# EAGLE design 16 PWM LEDs Module (EAGLE 6.3)
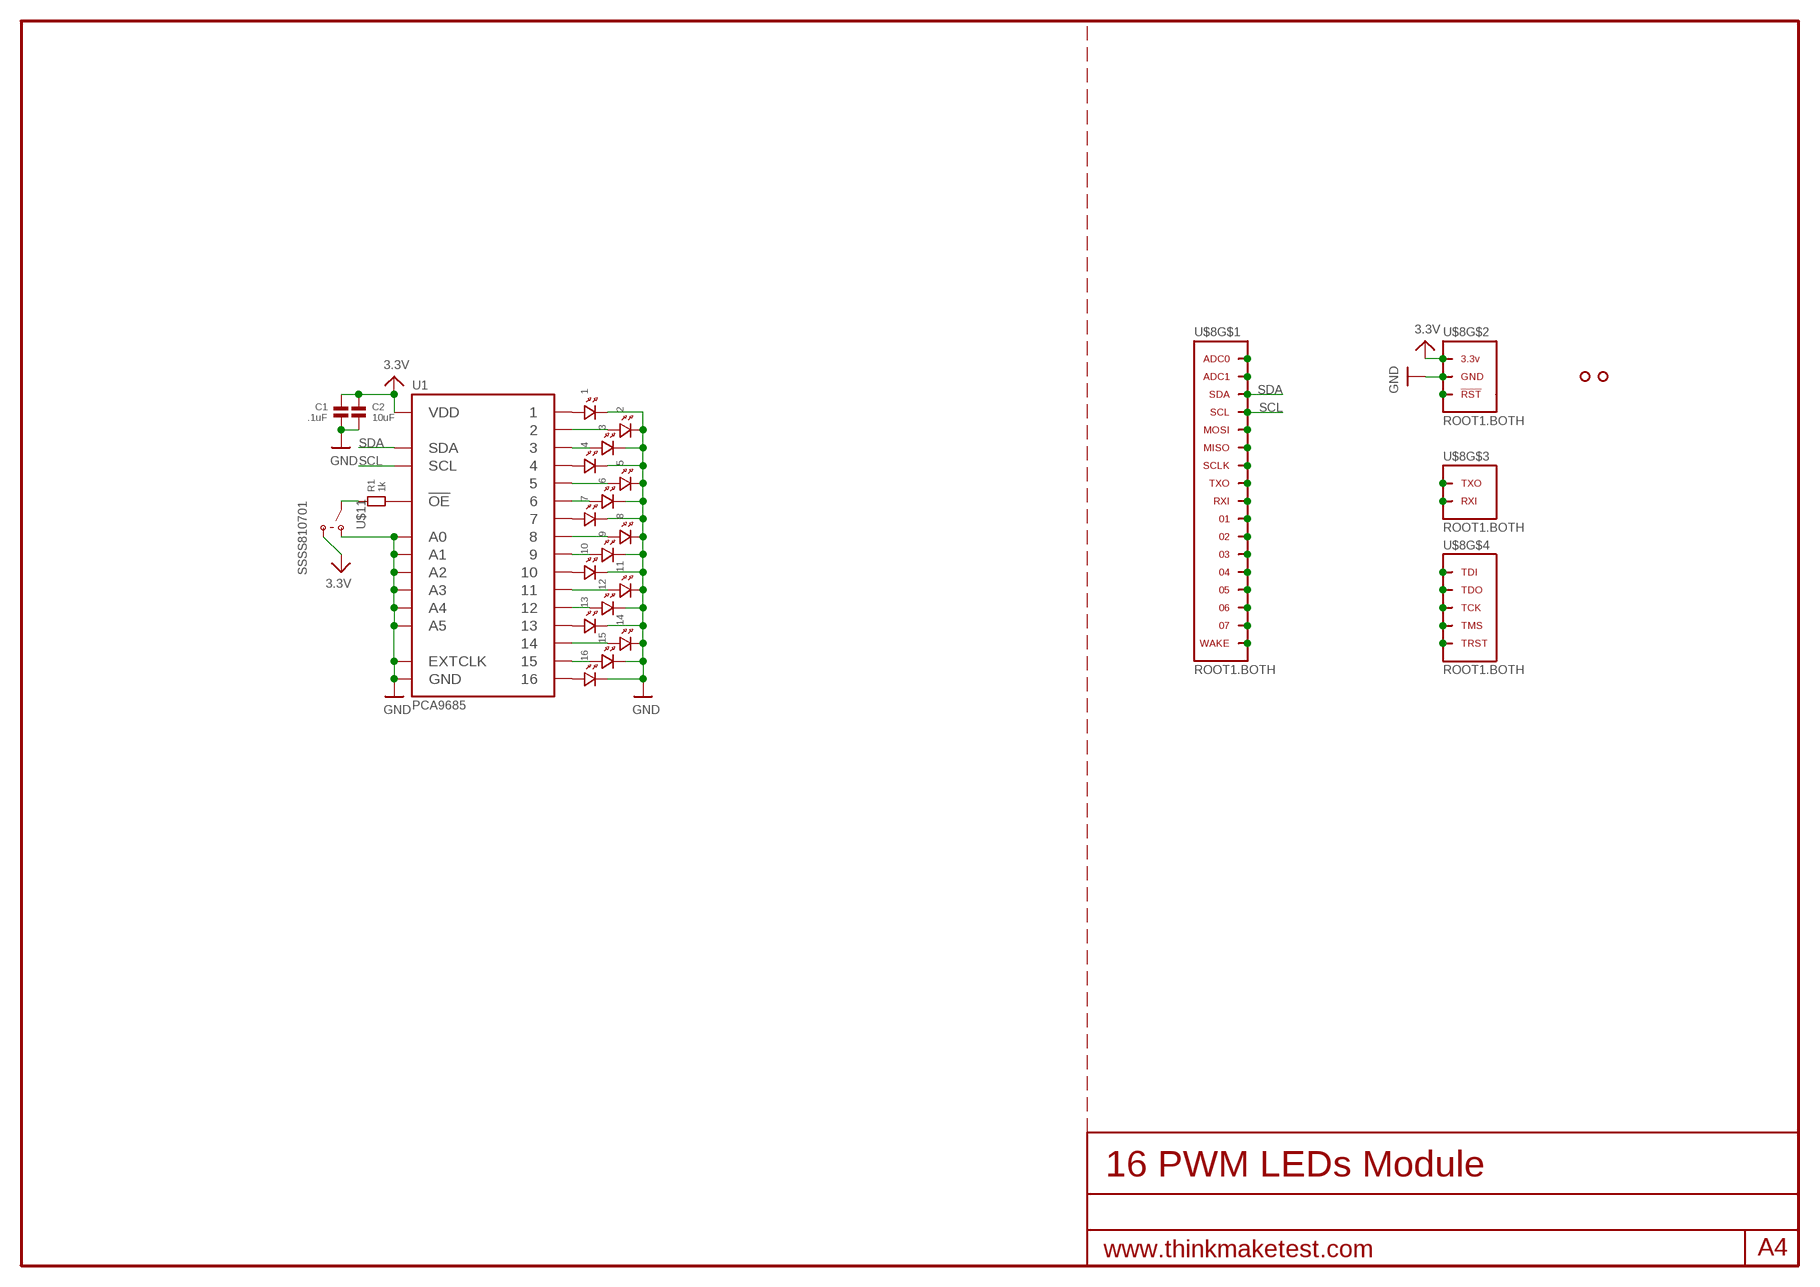
[diagram p0: schematic, sheet 1]

## Parts
1  LED.0603  [0603.LED]
2  LED.0603  [0603.LED]
3  LED.0603  [0603.LED]
4  LED.0603  [0603.LED]
5  LED.0603  [0603.LED]
6  LED.0603  [0603.LED]
7  LED.0603  [0603.LED]
8  LED.0603  [0603.LED]
9  LED.0603  [0603.LED]
10  LED.0603  [0603.LED]
11  LED.0603  [0603.LED]
12  LED.0603  [0603.LED]
13  LED.0603  [0603.LED]
14  LED.0603  [0603.LED]
15  LED.0603  [0603.LED]
16  LED.0603  [0603.LED]
C1  .1uF  CAPACITOR.0603  [0603]
C2  10uF  CAPACITOR.0805  [0805]
R1  1k  RESISTOR.0603  [0603]
U1  PCA9685  [HVQFN28]
U$3  HOLE.2MM  [2MM]
U$4  HOLE.2MM  [2MM]
U$8  ROOT1.BOTH  [ROOT1.BOTH]
U$11  SSSS810701  [SSSS810701]

## Nets
3.3V: C1.1 C2.1 U1.28(VDD) U$8.3.3V@1(3.3V) U$8.3.3V@2(3.3V) U$8.3.3V@3(3.3V) U$8.3.3V@4(3.3V) U$8.3.3V@5(3.3V) U$8.3.3V@6(3.3V) U$8.3.3V@7(3.3V) U$8.3.3V@8(3.3V) U$8.3.3V@9(3.3V) U$8.3.3V@10(3.3V) U$8.3.3V@11(3.3V) U$8.3.3V@12(3.3V) U$8.3.3V@13(3.3V) U$8.3.3V@14(3.3V) U$8.3.3V@15(3.3V) U$8.3.3V@16(3.3V) U$8.3.3V@17(3.3V) U$8.3.3V@18(3.3V) U$8.3.3V@19(3.3V) U$8.3.3V@20(3.3V) U$8.3.3V@21(3.3V) U$8.3.3V@22(3.3V) U$8.3.3V@23(3.3V) U$8.3.3V@24(3.3V) U$8.3.3V@VIA(3.3V) U$11.1(B)
GND: 1.P$2 2.P$2 3.P$2 4.P$2 5.P$2 6.P$2 7.P$2 8.P$2 9.P$2 10.P$2 11.P$2 12.P$2 13.P$2 14.P$2 15.P$2 16.P$2 C1.2 C2.2 U1.1(A0) U1.2(A1) U1.3(A2) U1.4(A3) U1.5(A4) U1.14(GND) U1.24(A5) U1.25(EXTCLK) U1.PAD(GND) U$8.GND@1(GND) U$8.GND@2(GND) U$8.GND@3(GND) U$8.GND@4(GND) U$8.GND@5(GND) U$8.GND@6(GND) U$8.GND@7(GND) U$8.GND@8(GND) U$8.GND@9(GND) U$8.GND@10(GND) U$8.GND@11(GND) U$8.GND@12(GND) U$8.GND@13(GND) U$8.GND@14(GND) U$8.GND@15(GND) U$8.GND@16(GND) U$8.GND@17(GND) U$8.GND@18(GND) U$8.GND@19(GND) U$8.GND@20(GND) U$8.GND@21(GND) U$8.GND@22(GND) U$8.GND@23(GND) U$8.GND@24(GND) U$8.GND@25(GND) U$8.GND@26(GND) U$8.GND@VIA(GND) U$11.3(A)
N$1: U$8.ADC0 U$8.ADC0@1(ADC0) U$8.ADC0@VIA(ADC0)
N$2: U$8.ADC1 U$8.ADC1@1(ADC1) U$8.ADC1@VIA(ADC1)
N$3: R1.2 U1.23(!OE)
N$4: R1.1 U$11.2(COM)
N$5: U$8.MOSI U$8.MOSI@1(MOSI) U$8.MOSI@VIA(MOSI)
N$6: U$8.MISO U$8.MISO@1(MISO) U$8.MISO@VIA(MISO)
N$7: U$8.SCLK U$8.SCLK@1(SCLK) U$8.SCLK@VIA(SCLK)
N$8: U$8.TXO U$8.TXO@1(TXO) U$8.TXO@VIA(TXO)
N$9: U$8.RXI U$8.RXI@1(RXI) U$8.RXI@VIA(RXI)
N$10: U$8.01 U$8.01@1 U$8.01@VIA
N$11: U$8.02 U$8.02@1 U$8.02@VIA
N$12: U$8.03 U$8.03@1 U$8.03@VIA
N$13: U$8.04 U$8.04@1 U$8.04@VIA
N$14: U$8.05 U$8.05@1 U$8.05@VIA
N$15: U$8.WAKE U$8.WAKE@1(WAKE) U$8.WAKE@VIA(WAKE)
N$16: 1.P$1 U1.6
N$17: 2.P$1 U1.7
N$19: 3.P$1 U1.8
N$23: 4.P$1 U1.9
N$25: 5.P$1 U1.10
N$26: 6.P$1 U1.11
N$27: 7.P$1 U1.12
N$28: 8.P$1 U1.13
N$29: 9.P$1 U1.15
N$31: 10.P$1 U1.16
N$32: 11.P$1 U1.17
N$33: 12.P$1 U1.18
N$34: 13.P$1 U1.19
N$35: 14.P$1 U1.20
N$36: 15.P$1 U1.21
N$37: 16.P$1 U1.22
N$38: U$8.TXO.DBG(TXO) U$8.TXO.DBG@1(TXO) U$8.TXO.DBG@VIA(TXO)
N$39: U$8.RST(!RST) U$8.RST@1(!RST) U$8.RST@VIA(!RST)
N$40: U$8.RXI.DBG(RXI) U$8.RXI.DBG@1(RXI) U$8.RXI.DBG@VIA(RXI)
N$41: U$8.TDI U$8.TDI@1(TDI) U$8.TDI@VIA(TDI)
N$42: U$8.07 U$8.07@1 U$8.07@VIA
N$43: U$8.06 U$8.06@1 U$8.06@VIA
N$44: U$8.TDO U$8.TDO@1(TDO) U$8.TDO@VIA(TDO)
N$45: U$8.TCK U$8.TCK@1(TCK) U$8.TCK@VIA(TCK)
N$46: U$8.TMS U$8.TMS@1(TMS) U$8.TMS@VIA(TMS)
N$47: U$8.TRST U$8.TRST@1(TRST) U$8.TRST@VIA(TRST)
SCL: U1.26(SCL) U$8.SCL U$8.SCL@1(SCL) U$8.SCL@VIA(SCL)
SDA: U1.27(SDA) U$8.SDA U$8.SDA@1(SDA) U$8.SDA@VIA(SDA)

## Library data of the parts
1-16 = .standardparts:LED
C1 C2 = .standardparts:CAPACITOR
R1 = .standardparts:RESISTOR
U1 = nxp:PCA9685
U$3 U$4 = .screw_holes:HOLE
U$8 = thinkmaketest:ROOT1
U$11 = alps:SSSS810701

## Board
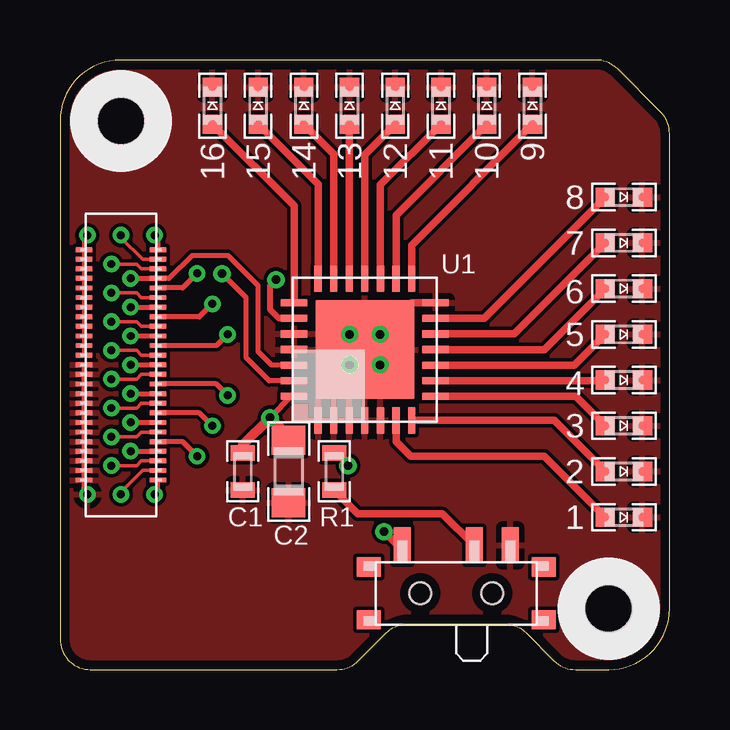
[diagram p1: board, top side]
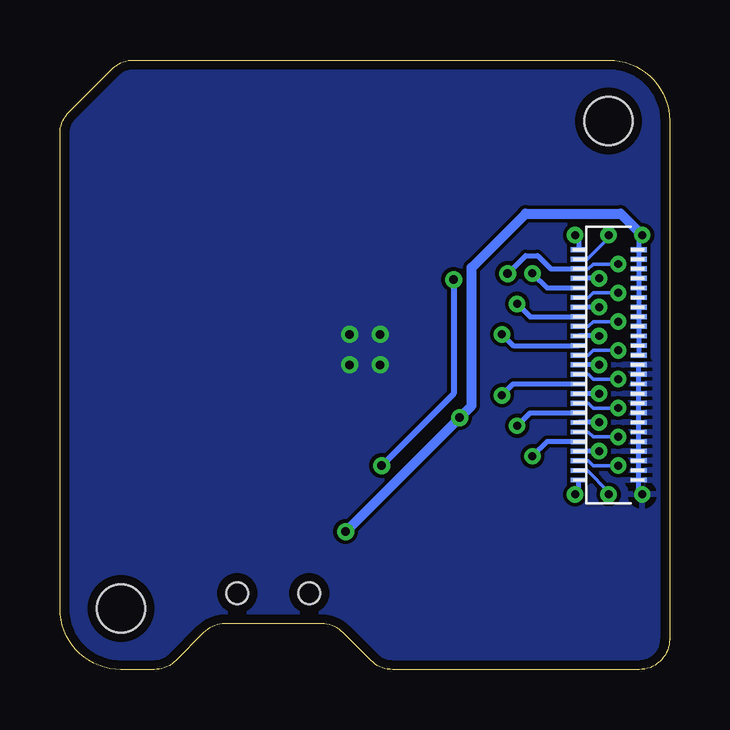
[diagram p2: board, bottom side, seen from below]

Size 25.4 x 25.4 mm. Coordinates in mm from the lower left corner, seen from the top.
Outline: 0,22.86 0,1.27 arc90 1.27,0 11.54,0 arc45 12.44,0.37 13.6,1.53 arc-45 14.5,1.91 18.52,1.91 arc-45 19.42,1.53 20.58,0.37 arc45 21.48,0 22.86,0 arc90 25.4,2.54 25.4,22.33 arc45 25.03,23.23 23.23,25.03 arc45 22.33,25.4 2.54,25.4 arc90 0,22.86
Copper layers (1*16): Top 0.0356mm / dielectric 1.5011mm / Bottom 0.0356mm
Design rules "default": minimum track width 6mil, minimum drill 13mil, track to track 6mil, track to pad 6mil, pad to pad 6mil, via to via 6mil, smd to smd 6mil, copper to edge 15mil, drill to drill 6mil, minimum pad ring 7mil, minimum via ring 7mil, stop-mask expansion 4mil, vias tented up to drill 16mil, thermal gap 10mil

### Footprints (pad centres in the part's own frame; a part is rotated, then mirrored left to right if it is on the bottom)
0603.LED = smd 0.8 x 0.8: P$1 -0.775,0; P$2 0.775,0
0603 = smd 0.65 x 1: 1 -0.775,0; 2 0.775,0
0805 = smd 1.2 x 1.4: 1 -1.3,0; 2 1.3,0
HVQFN28 = smd 1.1 x 0.3: 1 -2.95,1.95; 2 -2.95,1.3; 3 -2.95,0.65; 4 -2.95,0; 5 -2.95,-0.65; 6 -2.95,-1.3; 7 -2.95,-1.95; 15 2.95,-1.95; 16 2.95,-1.3; 17 2.95,-0.65; 18 2.95,0; 19 2.95,0.65; 20 2.95,1.3; 21 2.95,1.95 | smd 0.3 x 1.1: 8 -1.95,-2.95; 9 -1.3,-2.95; 10 -0.65,-2.95; 11 0,-2.95; 12 0.65,-2.95; 13 1.3,-2.95; 14 1.95,-2.95; 22 1.95,2.95; 23 1.3,2.95; 24 0.65,2.95; 25 0,2.95; 26 -0.65,2.95; 27 -1.3,2.95; 28 -1.95,2.95 | smd 4.1 x 4.1: PAD 0,0
2MM = hole 2: 0,0
ROOT1.BOTH = smd 0.66 x 0.2 bottom: 01 3.795,13.9; 02 3.795,13.5; 03 3.795,13.1; 3.3V@1 1.285,17.5; 3.3V@2 1.285,17.1; 3.3V@3 1.285,16.7; 3.3V@4 1.285,16.3; 3.3V@5 1.285,15.9; 3.3V@6 1.285,15.5; 3.3V@7 1.285,15.1; 3.3V@8 1.285,14.7; 3.3V@9 1.285,14.3; 3.3V@10 1.285,13.9; 3.3V@11 1.285,13.5; 3.3V@12 1.285,13.1; 04 3.795,12.7; 05 3.795,12.3; 06 3.795,11.9; 07 3.795,11.5; ADC0 3.795,17.5; ADC1 3.795,17.1; GND@1 1.285,7.9; GND@2 1.285,8.3; GND@3 1.285,8.7; GND@4 1.285,9.1; GND@5 1.285,9.5; GND@6 1.285,9.9; GND@7 1.285,10.3; GND@8 1.285,10.7; GND@9 1.285,11.1; GND@10 1.285,11.5; GND@11 1.285,11.9; GND@12 1.285,12.3; GND@13 1.285,12.7; MISO 3.795,15.5; MOSI 3.795,15.9; RST 3.795,7.9; RXI 3.795,14.3; RXI.DBG 3.795,10.3; SCL 3.795,16.3; SCLK 3.795,15.1; SDA 3.795,16.7; TCK 3.795,9.1; TDI 3.795,9.9; TDO 3.795,9.5; TMS 3.795,8.7; TRST 3.795,8.3; TXO 3.795,14.7; TXO.DBG 3.795,10.7; WAKE 3.795,11.1 | smd 0.7 x 0.2: 01@1 4.08,13.9; 02@1 4.08,13.5; 3.3V@13 1,17.5; 3.3V@14 1,17.1; 3.3V@15 1,16.7; 3.3V@16 1,16.3; 3.3V@17 1,15.9; 3.3V@18 1,15.5; 3.3V@19 1,15.1; 3.3V@20 1,14.7; 3.3V@21 1,14.3; 3.3V@22 1,13.9; 3.3V@23 1,13.5; 3.3V@24 1,13.1; 03@1 4.08,13.1; 04@1 4.08,12.7; 05@1 4.08,12.3; 06@1 4.08,11.9; 07@1 4.08,11.5; ADC0@1 4.08,17.5; ADC1@1 4.08,17.1; GND@14 1,7.9; GND@15 1,8.3; GND@16 1,8.7; GND@17 1,9.1; GND@18 1,9.5; GND@19 1,9.9; GND@20 1,10.3; GND@21 1,10.7; GND@22 1,11.1; GND@23 1,11.5; GND@24 1,11.9; GND@25 1,12.3; GND@26 1,12.7; MISO@1 4.08,15.5; MOSI@1 4.08,15.9; RST@1 4.08,7.9; RXI.DBG@1 4.08,10.3; RXI@1 4.08,14.3; SCL@1 4.08,16.3; SCLK@1 4.08,15.1; SDA@1 4.08,16.7; TCK@1 4.08,9.1; TDI@1 4.08,9.9; TDO@1 4.08,9.5; TMS@1 4.08,8.7; TRST@1 4.08,8.3; TXO.DBG@1 4.08,10.7; TXO@1 4.08,14.7; WAKE@1 4.08,11.1 | drill 0.33 pad 0.686: 01@VIA 2.94,13.9; 02@VIA 6.985,13.97; 3.3V@VIA 1.14,18.1; 03@VIA 2.14,13.3; 04@VIA 2.94,12.7; 05@VIA 2.14,12.1; 06@VIA 6.985,11.43; 07@VIA 2.94,11.5; ADC0@VIA 3.94,18.1; ADC1@VIA 2.54,18.1; GND@VIA 1.14,7.3; MISO@VIA 2.14,15.7; MOSI@VIA 5.715,16.51; RST@VIA 3.94,7.3; RXI.DBG@VIA 2.94,10.3; RXI@VIA 2.14,14.5; SCL@VIA 2.94,16.3; SCLK@VIA 2.94,15.1; SDA@VIA 2.14,16.9; TCK@VIA 2.94,9.1; TDI@VIA 2.14,9.7; TDO@VIA 5.715,8.89; TMS@VIA 2.14,8.5; TRST@VIA 2.54,7.3; TXO.DBG@VIA 6.35,10.16; TXO@VIA 6.35,15.24; WAKE@VIA 2.14,10.9
SSSS810701 = smd 0.7 x 1.5: 1 -2.25,2; 2 0.75,2; 3 2.25,2 | smd 1 x 0.8: 4.1 -3.65,1.1; 4.2 3.65,1.1; 4.3 -3.65,-1.1; 4.4 3.65,-1.1 | hole 0.9: 1.5,0; -1.5,0

### Placement (x,y rotation side)
1  23.5,6.35 0 top
2  23.5,8.26 0 top
3  23.5,10.16 0 top
4  23.5,12.06 0 top
5  23.5,13.97 0 top
6  23.5,15.88 0 top
7  23.5,17.78 0 top
8  23.5,19.68 0 top
9  19.68,23.5 90 top
10  17.78,23.5 90 top
11  15.88,23.5 90 top
12  13.97,23.5 90 top
13  12.06,23.5 90 top
14  10.16,23.5 90 top
15  8.26,23.5 90 top
16  6.35,23.5 90 top
C1  7.62,8.26 270 top
C2  9.53,8.26 270 top
R1  11.43,8.26 90 top
U1  12.7,13.34 90 top
U$3  22.86,2.54 90 top
U$4  2.54,22.86 90 top
U$8  0,0 0 top
U$11  16.51,3.17 0 top

### Tracks (layer width: path | path; a pad name or v marks a point on that pad's centre or on a via)
3.3V  (via drill 0.36)
  Top 0.254: U1.28 9.63,11.38 v8.75,10.5
  Top 0.305: v13.5,5.75 14.07,5.17 U$11.1
  Top 0.406: C2.1 9.53,9.72 v8.75,10.5 7.62,9.37 C1.1
  Bottom 0.406: U$8.3.3V@VIA 2.04,19 6,19 8.25,16.75 8.25,11 v8.75,10.5 v13.5,5.75
GND  (via drill 0.36)
  Top 0.305: U1.14 14.65,15.29 U1.PAD
  other vias: 13.34,13.97 12.06,13.97 12.06,12.7 13.34,12.7
  pour Bottom: 0,0 25.4,0 25.4,25.4 0,25.4
  pour Top: 0,0 25.4,0 25.4,25.4 0,25.4
N$3  (via drill 0.36)
  Top 0.254: U1.23 9.12,14.63 8.75,15 8.75,16 v9,16.25 | v12,8.5 11.47,9.03 R1.2
  Bottom 0.254: v9,16.25 9,11.5 v12,8.5
N$4
  Top 0.305: R1.1 12.41,6.5 15.94,6.5 U$11.2
N$16
  Top 0.305: U1.6 14,9.49 14.61,8.89 20.18,8.89 1.P$1
N$17
  Top 0.305: U1.7 20.59,10.38 2.P$1
N$19
  Top 0.305: U1.8 21.5,11.38 3.P$1
N$23
  Top 0.305: U1.9 22.69,12.04 4.P$1
N$25
  Top 0.305: U1.10 21.43,12.69 5.P$1
N$26
  Top 0.305: U1.11 20.18,13.34 6.P$1
N$27
  Top 0.305: U1.12 18.93,13.98 7.P$1
N$28
  Top 0.305: U1.13 17.67,14.63 8.P$1
N$29
  Top 0.305: U1.15 14.65,17.68 9.P$1
N$31
  Top 0.305: U1.16 14,18.94 10.P$1
N$32
  Top 0.305: U1.17 13.35,20.2 11.P$1
N$33
  Top 0.305: U1.18 12.7,21.45 12.P$1
N$34
  Top 0.305: U1.19 12.05,22.7 13.P$1
N$35
  Top 0.305: U1.20 11.4,21.48 14.P$1
N$36
  Top 0.305: U1.21 10.75,20.23 15.P$1
N$37
  Top 0.305: U1.22 9.75,19.32 16.P$1
SCL
  Top 0.203: U1.26 8.81,12.69 8.25,13.25 8.25,16 7,17.25 5.5,17.25 4.55,16.3 U$8.SCL@1
SDA  (via drill 0.36)
  Top 0.203: U1.27 8.71,12.04 7.75,13 7.75,15.5 v6.75,16.5
  Bottom 0.203: v6.75,16.5 6,17.25 5.5,17.25 4.95,16.7 U$8.SDA

### Text on the board
tDocu: ON | OFF
bDocu: Cruz Monrreal II | InnovativeMaker.com | v1.1